# Altium schematic sheet Main.SchDoc
size A4; SheetNumber: 1; SheetTotal: 4
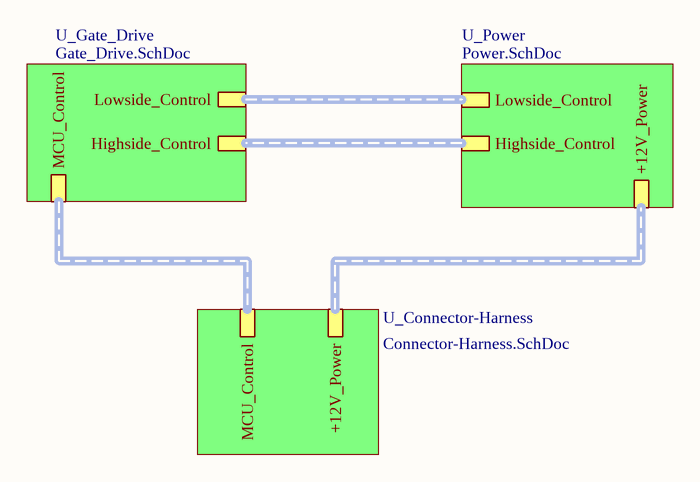
[diagram p0: Main.SchDoc]

## Sub-sheets
U_Connector-Harness = Connector-Harness.SchDoc: +12V_Power (harness +12V_Power), MCU_Control (harness MCU_Signals)
U_Gate_Drive = Gate_Drive.SchDoc: Lowside_Control (harness Gate_Signals), Highside_Control (harness Gate_Signals), MCU_Control (harness MCU_Signals)
U_Power = Power.SchDoc: Lowside_Control (harness Gate_Signals), Highside_Control (harness Gate_Signals), +12V_Power (harness +12V_Power)

## Buses and harness runs
harness sheet U_Connector-Harness/+12V_Power = sheet U_Power/+12V_Power
harness sheet U_Connector-Harness/MCU_Control = sheet U_Gate_Drive/MCU_Control
harness sheet U_Gate_Drive/Highside_Control = sheet U_Power/Highside_Control
harness sheet U_Gate_Drive/Lowside_Control = sheet U_Power/Lowside_Control